# Altium schematic sheet Sheet2.SchDoc
size A3; SheetNumber: 1; SheetTotal: 1
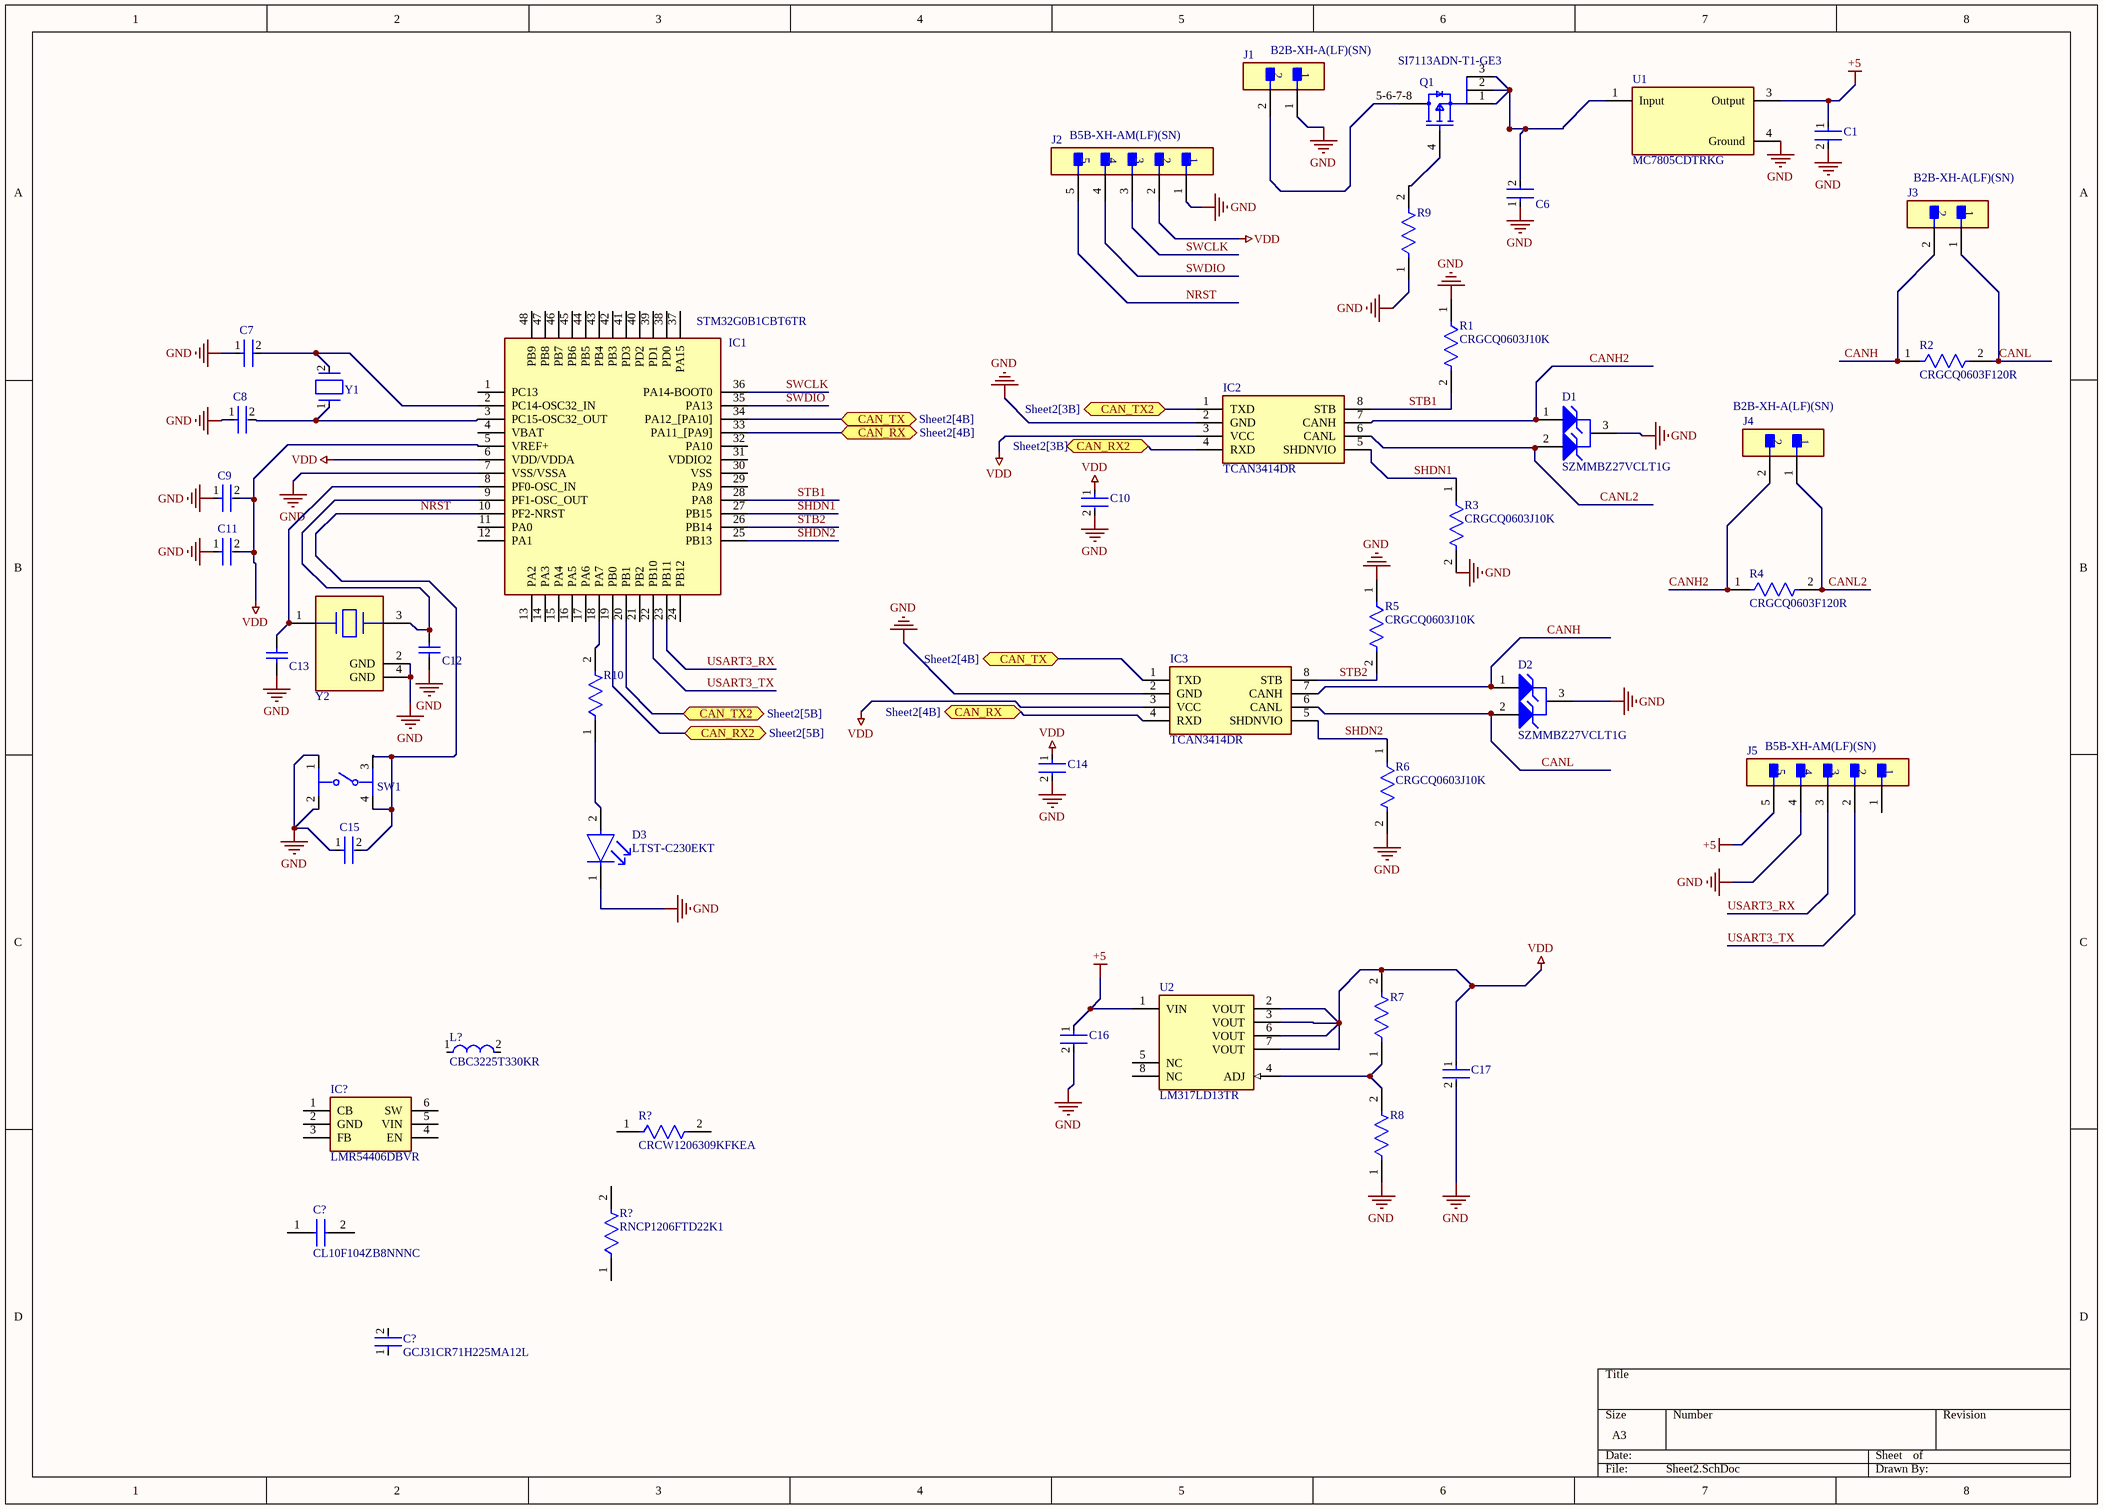
[diagram p0: Sheet2.SchDoc]

## Parts
(Parts that share a designator on the sheet are numbered #1, #2 ... from top to bottom, then left to right.)
C1  CC0805KRX7R5BB104  [FP-CC0805-EA-MFG]  (value not drawn)
C6  C0805C104K5RACTU  [FP-C0805C-DN-MFG]  (value not drawn)
C7  C0805C519D3HACTU  [FP-C0805C-DN-MFG]  (value not drawn)
C8  C0805C519D3HACTU  [FP-C0805C-DN-MFG]  (value not drawn)
C9  C0805C104K5RACTU  [FP-C0805C-DN-MFG]  (value not drawn)
C10  CC0805KRX7R5BB104  [FP-CC0805-EA-MFG]  (value not drawn)
C11  C0805C104K5RACTU  [FP-C0805C-DN-MFG]  (value not drawn)
C12  GRM1885C1H100JA01D  [CAPC1608X90X35LL10T15]  (value not drawn)
C13  GRM1885C1H100JA01D  [CAPC1608X90X35LL10T15]  (value not drawn)
C14  CC0805KRX7R5BB104  [FP-CC0805-EA-MFG]  (value not drawn)
C15  C0805C104K5RACTU  [FP-C0805C-DN-MFG]  (value not drawn)
C16  CC0805KRX7R5BB104  [FP-CC0805-EA-MFG]  (value not drawn)
C17  CC0805KRX7R5BB104  [FP-CC0805-EA-MFG]  (value not drawn)
C?#1  CL10F104ZB8NNNC  [CAPC1608X90N]
C?#2  GCJ31CR71H225MA12L  [FP-GCJ31C-0_3-IPC_B]
D1  SZMMBZ27VCLT1G  [ONSC-SOT-23-3-318-08_V]
D2  SZMMBZ27VCLT1G  [ONSC-SOT-23-3-318-08_V]
D3  LTST-C230EKT  [FP-LTST-C230EKT-MFG]
IC1  STM32G0B1CBT6TR  [QFP50P900X900X160-48N]
IC2  TCAN3414DR  [SOIC127P600X175-8N]
IC3  TCAN3414DR  [SOIC127P600X175-8N]
IC?  LMR54406DBVR  [SOT95P280X145-6N]
J1  B2B-XH-A(LF)(SN)  [FP-B2B-XH-A_LF_SN-MFG]
J2  B5B-XH-AM(LF)(SN)  [FP-B5B-XH-AM_LF_SN-MFG]
J3  B2B-XH-A(LF)(SN)  [FP-B2B-XH-A_LF_SN-MFG]
J4  B2B-XH-A(LF)(SN)  [FP-B2B-XH-A_LF_SN-MFG]
J5  B5B-XH-AM(LF)(SN)  [FP-B5B-XH-AM_LF_SN-MFG]
L?  CBC3225T330KR  [FP-CB3225-IPC_A]
Q1  SI7113ADN-T1-GE3  [FP-S16-2667-SINGLE-MFG]
R1  CRGCQ0603J10K  [FP-CRGCQ0603-IPC_C]
R2  CRGCQ0603F120R  [FP-CRGCQ0603-IPC_C]
R3  CRGCQ0603J10K  [FP-CRGCQ0603-IPC_C]
R4  CRGCQ0603F120R  [FP-CRGCQ0603-IPC_C]
R5  CRGCQ0603J10K  [FP-CRGCQ0603-IPC_C]
R6  CRGCQ0603J10K  [FP-CRGCQ0603-IPC_C]
R7  CRGCQ0603F1K2  [FP-CRGCQ0603-IPC_C]  (value not drawn)
R8  RC3216J202CS  [FP-RC3216-IPC_A]  (value not drawn)
R9  CRGCQ0603F1K2  [FP-CRGCQ0603-IPC_C]  (value not drawn)
R10  RC3216J202CS  [FP-RC3216-IPC_A]  (value not drawn)
R?#1  CRCW1206309KFKEA  [FP-CRCW1206-e3-IPC_B]
R?#2  RNCP1206FTD22K1  [FP-RNCP1206-IPC_C]
SW1  PTS647SK38SMTR2LFS  [FP-PTS647SK38SMTR2LFS-MFG]  (value not drawn)
U1  MC7805CDTRKG  [FP-369C-MFG]
U2  LM317LD13TR  [FP-SO-8-0016023-MFG]
Y1  ABS06-32.768KHZ-9-1-T  [FP-ABS06-MFG]  (value not drawn)
Y2  ABM8G-24.000MHZ-B4Y-T  [FP-ABM8G-MFG]  (value not drawn)

## Ports
CAN_RX2 (bidir, see Sheet2[3B]), CAN_RX2 (bidir, see Sheet2[5B]), CAN_RX (bidir, see Sheet2[4B]), CAN_TX2 (bidir, see Sheet2[3B]), CAN_TX2 (bidir, see Sheet2[5B]), CAN_TX (bidir, see Sheet2[4B])

## Nets
+5: C1.1 C16.1 J5.5 U1.3(Output) U2.1(VIN)
GND: C1.2 C6.1 C7.1 C8.1 C9.1 C10.2 C11.1 C12.1 C13.1 C14.2 C15.1 C16.2 C17.2 D1.3(K) D2.3(K) D3.1(C) IC1.7(VSS/VSSA) IC2.2(GND) IC3.2(GND) J1.1 J2.1 J5.4 R1.1 R3.2 R5.1 R6.2 R8.1 R9.1 SW1.1 SW1.2 U1.4(Ground) Y2.2(GND) Y2.4(GND)
VDD: C9.2 C10.1 C11.2 C14.1 C17.1 IC1.5(VREF+) IC1.6(VDD/VDDA) IC2.3(VCC) IC3.3(VCC) J2.2 R7.2 U2.2(VOUT) U2.3(VOUT) U2.6(VOUT) U2.7(VOUT)
CAN_RX: IC1.33(PA11_[PA9]) IC3.4(RXD) ; port CAN_RX
CAN_RX2: IC1.19(PB0) IC2.4(RXD) ; port CAN_RX2
CAN_TX: IC1.34(PA12_[PA10]) IC3.1(TXD) ; port CAN_TX
CAN_TX2: IC1.20(PB1) IC2.1(TXD) ; port CAN_TX2
CANH: D2.1(A1) IC3.7(CANH) J3.2 R2.1
CANH2: D1.1(A1) IC2.7(CANH) J4.2 R4.1
CANL: D2.2(A2) IC3.6(CANL) J3.1 R2.2
CANL2: D1.2(A2) IC2.6(CANL) J4.1 R4.2
NRST: C15.2 IC1.10(PF2-NRST) J2.5 SW1.3 SW1.4
SHDN1: IC1.27(PB15) IC2.5(SHDNVIO) R3.1
SHDN2: IC1.25(PB13) IC3.5(SHDNVIO) R6.1
STB1: IC1.28(PA8) IC2.8(STB) R1.2
STB2: IC1.26(PB14) IC3.8(STB) R5.2
SWCLK: IC1.36(PA14-BOOT0) J2.3
SWDIO: IC1.35(PA13) J2.4
USART3_RX: IC1.23(PB11) J5.3
USART3_TX: IC1.22(PB10) J5.2
NetC6_2: C6.2 Q1.1(S) Q1.2(S) Q1.3(S) U1.1(Input)
NetC7_2: C7.2 IC1.2(PC14-OSC32_IN) Y1.2
NetC8_2: C8.2 IC1.3(PC15-OSC32_OUT) Y1.1
NetC12_2: C12.2 IC1.9(PF1-OSC_OUT) Y2.3
NetC13_2: C13.2 IC1.8(PF0-OSC_IN) Y2.1
NetD3_2: D3.2(A) R10.1
NetIC1_18: IC1.18(PA7) R10.2
NetJ1_2: J1.2 Q1.5-6-7-8(D)
NetQ1_4: Q1.4(G) R9.2
NetR7_1: R7.1 R8.2 U2.4(ADJ)

Not connected (* = marked no-connect by the designer): C?#1 1 2; C?#2 1 2; IC1 1(PC13) 4(VBAT) 11(PA0) 12(PA1) 13(PA2) 14(PA3) 15(PA4) 16(PA5) 17(PA6) 21(PB2) 24(PB12) 29(PA9) 30(VSS) 31(VDDIO2) 32(PA10) 37(PA15) 38(PD0) 39(PD1) 40(PD2) 41(PD3) 42(PB3) 43(PB4) 44(PB5) 45(PB6) 46(PB7) 47(PB8) 48(PB9); IC? 1(CB) 2(GND) 3(FB) 4(EN) 5(VIN) 6(SW); J5 1; L? 1 2; R?#1 1 2; R?#2 1 2; U2 5(NC) 8(NC)

## Library data of the parts
C1 C10 C14 C16 C17 = CMP-03422-000810-2: CAP CER X7R 0805; RoHS Compliant: Yes
C6 C9 C11 C15 = CMP-2007-00279-2: CAP CER 0.1UF 50V X7R 0805; Manufacturer: KEMET; Value: 0.10 μF; Tolerance: 0.1; Temperature Coefficient: 30ppm/°C; Material: Ceramic; Manufacturer Part Number: C0805C104K5RACTU; Device Class L2: Capacitors; Temperature Range Low: -55°C; Voltage Rating: 50 V; Digikey Description: CAP CER 0.1UF 50V X7R 0805; Category: Cap; ComponentLink2Description: Datasheet; Octopart: https://octopart.com/c0805c104k5ractu-kemet-143926; RoHS: TRUE; ComponentLink2URL: https://content.kemet.com/datasheets/KEM_C1003_C0G_SMD.pdf; Temperature Characteristic: X7R; Temperature: -55°C to +125°C; Height: 0.88mm; Temperature Range High: +125°C; Device Class L1: Passive Components; Automotive: No; Lead Free: Yes; Ipc Land Pattern Name: CAPC200125X78; Device Class L3: Ceramic Capacitors; Mouser Description: Cap Ceramic 0.1uF 50V X7R 10% SMD 2.0 x 1.2 mm 125 C Paper T/R; Capacitance: 0.10 μF; Package: C0805C-DN
C7 C8 = CMP-03020-033346-1: C0805 5.1 pF X8R 30ppm/°C 0.5 pF 25 V; Manufacturer: KEMET; Voltage Rating: 25 V; Tolerance: 0.5 pF; Capacitance: 5.1 pF; Value: 5.1 pF; Material: Ceramic; Category: Cap; Lead Free: Yes; Temperature Characteristic: X8R; Manufacturer Part Number: C0805C519D3HACTU; Ipc Land Pattern Name: CAPC200125X78; ComponentLink2Description: Datasheet; Package: C0805C-DN; Device Class L2: Capacitors; Automotive: No; Octopart: https://octopart.com/c0805c519d3hactu-kemet-88727353; Device Class L1: Passive Components; Temperature Coefficient: 30ppm/°C; Temperature Range High: +125°C; Height: 0.88mm; Temperature Range Low: -55°C; ComponentLink2URL: https://content.kemet.com/datasheets/KEM_C1003_C0G_SMD.pdf; Device Class L3: Ceramic Capacitors; RoHS: TRUE; Temperature: -55°C to +125°C
C12 C13 = CMP-2006-02592-1: Manufacturer: Murata; Part Number: GRM1885C1H100JA01D
C?#1 = CL10F104ZB8NNNC: Capacitor; Manufacturer_Name: SAMSUNG; Datasheet Link: http://uk.rs-online.com/web/p/products/7665449; Height: 0.9mm; Manufacturer_Part_Number: CL10F104ZB8NNNC; Mouser Part Number: 187-CL10F104ZB8NNNC; Mouser Price/Stock: https://www.mouser.co.uk/ProductDetail/Samsung-Electro-Mechanics/CL10F104ZB8NNNC?qs=349EhDEZ59rBbGrsT%2FDZAg%3D%3D; Arrow Part Number: CL10F104ZB8NNNC; Arrow Price/Stock: https://www.arrow.com/en/products/cl10f104zb8nnnc/samsung-electro-mechanics?region=nac
C?#2 = CMP-06035-000750-1: Cap Ceramic 2.2uF 50V X7R 20% Pad SMD 1206 Soft Termination  +125°C Automotive T/R
D1 D2 = CMP-1060-01002-1: 40 W Peak Power Zener Transient Voltage Suppressor, Dual Common Cathode Zeners for ESD Protection, 3-Pin SOT-23, Pb-Free, Tape and Reel; Manufacturer: On Semiconductor; VZ Typ (V): 27; ComponentLink2Description: Datasheet; ComponentLink1Description: Manufacturer URL; PackageVersion: Rev. AP, 11/2009; Packing: Tape and Reel; ComponentLink2URL: http://www.onsemi.cn/pub_link/Collateral/MMBZ15VDLT1-D.PDF; PackageReference: SOT-23-3-318-08; ComponentLink3Description: Package Specification; ComponentLink3URL: http://www.onsemi.cn/pub_link/Collateral/318-08.PDF; DatasheetVersion: Rev. 12; RoHS: Pb-Free; ComponentLink1URL: http://www.onsemi.com/; PackageDescription: 3-Pin Small Outline Transistor, Body 2.92 x 1.3 mm, Pitch 0.95 mm; PartNumber: SZMMBZ27VCLT1G; Mounting Technology: Surface Mount
D3 = CMP-22017-000030-1: LED RED CLEAR CHIP SMD; Forward Current: 30mA; Test Current: 10mA; Number of Elements: 1; Viewing Angle: 130°; Dominant Wavelength: 621nm; Forward Voltage: 2V; Lens Style: Diffused; Power Rating: 100mW; Reverse Voltage: 5V; Wavelength: 630nm; Luminous Intensity: 6mcd; Lens Color: Colorless; Case/Package: 1206; Case Code (Imperial): 1206; Package Quantity: 1; Lead Free: Lead Free; Case Code (Metric): 3216; Height: 1.1mm; Lens Transparency: Clear; Mount: Surface Mount; Depth: 1.6mm; Number of LEDs: 1; Power Dissipation: 100mW; Max Operating Temperature: 85°C; Width: 1.6mm; Color: Red; Number of Pins: 2; Min Operating Temperature: -55°C; Packaging: Tape and Reel; Radiation Hardening: No; Illumination Color: Red; Length: 3.2mm
IC1 = STM32G0B1CBT6TR: Integrated Circuit; Manufacturer_Name: STMicroelectronics; Datasheet Link: https://www.st.com/resource/en/datasheet/stm32g0b1cc.pdf; Height: 1.6mm; Manufacturer_Part_Number: STM32G0B1CBT6TR; Mouser Part Number: 511-STM32G0B1CBT6TR; Mouser Price/Stock: https://www.mouser.co.uk/ProductDetail/STMicroelectronics/STM32G0B1CBT6TR?qs=HoCaDK9Nz5cqFCA6TLpp%252Bw%3D%3D; Arrow Part Number: STM32G0B1CBT6TR; Arrow Price/Stock: https://www.arrow.com/en/products/stm32g0b1cbt6tr/stmicroelectronics?utm_currency=USD&region=nac
IC2 IC3 = TCAN3414DR: Integrated Circuit; Manufacturer_Name: Texas Instruments; Datasheet Link: https://www.ti.com/lit/ds/symlink/tcan3414.pdf?ts=1713723144569&ref_url=https%253A%252F%252Fwww.mouser.ch%252F; Height: 1.75mm; Manufacturer_Part_Number: TCAN3414DR; Mouser Part Number: 595-TCAN3414DR; Mouser Price/Stock: https://www.mouser.co.uk/ProductDetail/Texas-Instruments/TCAN3414DR?qs=mELouGlnn3egF2AojRJddw%3D%3D; Arrow Part Number: TCAN3414DR; Arrow Price/Stock: https://www.arrow.com/en/products/tcan3414dr/texas-instruments?utm_currency=USD&region=nac
IC? = LMR54406DBVR: Integrated Circuit; Manufacturer_Name: Texas Instruments; Datasheet Link: https://www.ti.com/lit/ds/symlink/lmr54406.pdf?ts=1659688249350&ref_url=https%253A%252F%252Fwww.ti.com%252Fproduct%252FLMR54406%252Fpart-details%252FLMR54406DBVR; Height: 1.45mm; Manufacturer_Part_Number: LMR54406DBVR; Mouser Part Number: 595-LMR54406DBVR; Mouser Price/Stock: https://www.mouser.co.uk/ProductDetail/Texas-Instruments/LMR54406DBVR?qs=rSMjJ%252B1ewcQLNU8KVBwgHQ%3D%3D; Arrow Part Number: LMR54406DBVR; Arrow Price/Stock: https://www.arrow.com/en/products/lmr54406dbvr/texas-instruments?utm_currency=USD&region=nac
J1 J3 J4 = CMP-2000-05888-3: CONN HEADER VERT 2POS 2.5MM; Current Rating: 3A; Voltage Rating: 250V; Number of Contacts: 2; Contact Resistance: 20mR; Wire/Cable Gauge: 22AWG; Insulation Resistance: 1GR; Connector Type: Male Pin; Packaging: Bulk; Contact Material: Brass; Lead Free: Lead Free; Orientation: Straight; Contact Plating: Tin; Max Current Rating: 3A; Termination: Solder; Fastening Type: Detent; Depth: 5.75mm; Housing Material: Polyamide; REACH SVHC: No SVHC; Series: XH; Voltage Rating (AC): 250V; Number of Positions: 2; Color: Natural; Contact Type: Male Pin; Max Voltage Rating (DC): 250V; Pitch: 2.5mm; Lead Pitch: 2.5mm; Mount: Through Hole; Max Operating Temperature: 85°C; Length: 7.4mm; Max Voltage Rating (AC): 250V; Min Operating Temperature: -25°C; Number of Rows: 1; Housing Color: White
J2 J5 = CMP-17439-000304-1: CONN HEADER VERT 5POS 2.5MM; Mated Stacking Heights: 9.8mm; Voltage Rating: 250V; Max Current Rating: 3A; Number of Positions: 5; Contact Resistance: 20mR; Depth: 5.75mm; Connector Type: Header; Color: Green; Insulation Material: Nylon; Contact Plating: Copper; Length: 14.9mm; Fastening Type: Detent; Contact Material: Brass; Number of Rows: 1; Contact Type: Male Pin; Housing Material: Polyamide; Housing Color: White; Lead Free: Lead Free; Max Voltage Rating (AC): 250V; Mount: Through Hole; Contact Shape: Square; Min Operating Temperature: -25°C; Packaging: Bulk; Orientation: Straight; Insulation Color: Natural; Series: XH; Flammability Rating: UL94 V-0; Contact Finish - Mating: TIN; Max Operating Temperature: 85°C; Termination: Solder; Pitch: 2.5mm
L? = CMP-14484-000067-1: SMD Inductors 33uH ±10% 0.57A 0.533Ω 1210; Saturation Current: 500mA; Shielding: Unshielded; Test Frequency: 100kHz; DC Current: 570mA; DC Resistance (DCR): 533mR; Self Resonant Frequency: 13MHz; Core Material: Ferrite; Termination: SMD/SMT; Min Operating Temperature: -40°C; Width: 0.098inch; Case Code (Imperial): 1210; Depth: 2.7mm; Length: 3.2mm; Case Code (Metric): 3225; Max Operating Temperature: 105°C; Inductance: 33uH; Current Rating: 570mA; Military Standard: Not; Tolerance: 10%; Lead Free: Lead Free; Package Quantity: 1000; Height: 2.5mm; Height - Seated (Max): 0.106inch; Max DC Current: 570mA; Resistor Type: Wirewound; Series: CBC; Packaging: Tape and Reel; Halogen Free: Halogen Free; Case/Package: 1210; Radiation Hardening: No; RoHS Compliant: Yes; Mount: Surface Mount; Inductance Tolerance: 10%
Q1 = CMP-02550-000064-1: MOSFET P-CH 100V 10.8A 1212-8; Manufacturer: Vishay; Pulse Drain Current: -20A; Reverse Recovery Charge: 80nC; Standoff Height: 0mm; Max Junction Temp: +150°C; Max Forward Diode Voltage: -1.2V; Depletion Mode: False; Turn Off Delay Time: 20ns; Drain To Source Resistance: 0.11Ω; Turn On Delay Time: 10ns; Rthja Max: 36°C/W; Gate Charge At Vgs: 10.9nC @ -10V; Transconductance: 8S; Typ Forward Diode Voltage: -0.8V; Threshold Vgs Max: -2.6V; Drain To Source Voltage: -100V; Power Dissipation: 3.5W; Threshold Vgs Min: -1.1V; Input Capacitace At Vds: 515pF @ -50V; Continuous Drain Current: -3.8A; Number Of P Channels: 1; Reverse Recovery Time: 43ns; Gate To Source Voltage: 20V; Automotive: No; Lead Free: Yes; Temperature Range Low: -55°C; Device Class L1: Discrete Semiconductors; Temperature: -55°C to +150°C; ComponentLink2URL: http://www.vishay.com/docs/77678/si7113adn.pdf; Device Class L3: MOSFETs; Device Class L2: Transistors; Footprint Url: https://www.vishay.com/docs/72597/72597.pdf; Digikey Description: MOSFET P-CH 100V 10.8A 1212-8; RoHS: TRUE; Height: 1.17mm; Package: S16-2667-SINGLE; Octopart: https://octopart.com/si7113adn-t1-ge3-vishay-88182558; ComponentLink2Description: Datasheet; Temperature Range High: +150°C; Manufacturer Part Number: SI7113ADN-T1-GE3; Category: Trans; Drain To Source Breakdown Voltage: -100V; Number Of Channels: 1
R1 R3 R5 R6 = CMP-03211-009884-1: CRGCQ 0603 10K 5%; Manufacturer: TE Connectivity; Tolerance: 0.05; Power Rating: 0.1W; Resistance: 10KΩ; Voltage Rating: 75V; Value: 10KΩ; Temperature Coefficient: ±100ppm/°C; Composition: Thick Film; ComponentLink2URL: https://www.te.com/commerce/DocumentDelivery/DDEController?Action=showdoc&DocId=Data+Sheet%7F1773204-3%7F1%7Fpdf%7FEnglish%7FENG_DS_1773204-3_1.pdf%7F4-2176339-923; Device Class L1: Passive Components; Package: CRGCQ0603; Mouser Description: Res Thick Film 0603 10K Ohm 5% 0.1W(1/10W) ±100ppm/C Pad SMD Automotive T/R; Temperature Range High: +155°C; Category: Res; Device Class L2: Resistors; Height: 0.55mm; RoHS: TRUE; Lead Free: Yes; Ipc Land Pattern Name: RESC16080X45; Temperature: -55°C to +155°C; Series: CRGCQ; Digikey Description: CRGCQ 0603 10K 5%; Octopart: https://octopart.com/crgcq0603j10k-te+connectivity-91018097; Device Class L3: Chip SMD Resistors; Ambient Temperature Range High: +70°C; ComponentLink2Description: Datasheet; Temperature Range Low: -55°C; Manufacturer Part Number: CRGCQ0603J10K
R2 R4 = CMP-03211-001601-1: CRGCQ0603 120Ω 1% ±100ppm/°C 75V; Manufacturer: TE Connectivity; Tolerance: 0.01; Power Rating: 0.1W; Voltage Rating: 75V; Device Class L2: Resistors; Ambient Temperature Range High: +70°C; Mouser Description: Res, Aec-Q200, Thick Film, 120R, 1%, 0603; Composition: Thick Film; Device Class L1: Passive Components; Temperature Range Low: -55°C; Manufacturer Part Number: CRGCQ0603F120R; Lead Free: Yes; Value: 120Ω; ComponentLink2Description: Datasheet; Device Class L3: Chip SMD Resistors; Package: CRGCQ0603; Ipc Land Pattern Name: RESC16080X45; Height: 0.55mm; Category: Res; RoHS: TRUE; Temperature Range High: +155°C; Resistance: 120Ω; Octopart: https://octopart.com/crgcq0603f120r-te+connectivity-91018039; Temperature Coefficient: ±100ppm/°C; ComponentLink2URL: https://www.te.com/commerce/DocumentDelivery/DDEController?Action=showdoc&DocId=Data+Sheet%7F1773204-3%7F1%7Fpdf%7FEnglish%7FENG_DS_1773204-3_1.pdf%7F4-2176339-482; Temperature: -55°C to +155°C; Series: CRGCQ
R7 R9 = CMP-03211-000516-1: CRGCQ 0603 1K2 1%; Manufacturer: TE Connectivity; Power Rating: 0.1W; Resistance: 1.2KΩ; Value: 1.2KΩ; Voltage Rating: 75V; Temperature Coefficient: ±100ppm/°C; Tolerance: 0.01; Octopart: https://octopart.com/crgcq0603f1k2-te+connectivity-91018051; ComponentLink2Description: Datasheet; ComponentLink2URL: https://www.te.com/commerce/DocumentDelivery/DDEController?Action=showdoc&DocId=Data+Sheet%7F1773204-3%7F1%7Fpdf%7FEnglish%7FENG_DS_1773204-3_1.pdf%7F4-2176339-710; Category: Res; Temperature: -55°C to +155°C; Temperature Range High: +155°C; Ipc Land Pattern Name: RESC16080X45; Device Class L2: Resistors; Height: 0.55mm; Ambient Temperature Range High: +70°C; RoHS: TRUE; Package: CRGCQ0603; Temperature Range Low: -55°C; Digikey Description: CRGCQ 0603 1K2 1%; Series: CRGCQ; Lead Free: Yes; Manufacturer Part Number: CRGCQ0603F1K2; Device Class L1: Passive Components; Composition: Thick Film; Device Class L3: Chip SMD Resistors
R8 R10 = CMP-13261-004107-1: Res Thick Film 1206 2kΩ 5% 0.25W ±100ppm/°C Molded SMD T/R; Voltage Rating (DC): 200V; Resistance: 2kR; Max Power Dissipation: 250mW; Features: Moisture Resistant; Min Operating Temperature: -55°C; Radiation Hardening: No; Lead Free: Lead Free; Height: 0.026inch; Tolerance: 5%; Case/Package: 1206; Case Code (Metric): 3216; Max Operating Temperature: 155°C; Case Code (Imperial): 1206; Length: 0.126inch; Contact Plating: Tin; Temperature Coefficient: 100ppm/°C; Packaging: Tape and Reel; Depth: 1.6mm; Composition: Thick Film; Number of Terminations: 2; Width: 0.063inch
R?#1 = CMP-1014-00790-3: RES Thick Film, 309kΩ, 1%, 0.25W, 100ppm/°C, 1206; Max Power Dissipation: 250mW; Voltage Rating (DC): 200V; Resistance: 309kR; Min Operating Temperature: -55°C; Width: 0.063inch; Number of Terminations: 2; Radiation Hardening: No; Temperature Coefficient: 100ppm/°C; Length: 3.2mm; Tolerance: 1%; Lead Free: Lead Free; Military Standard: Not; Weight: 0.000353oz; Number of Pins: 2; Contact Plating: Tin; Packaging: Tape and Reel; Power Rating: 250mW; Height: 0.024inch; Features: Automotive AEC-Q200; Case/Package: 1206; Max Operating Temperature: 155°C; Case Code (Imperial): 1206; Composition: Thick Film; Depth: 1.6mm; Termination: SMD/SMT; Package Quantity: 5000; Case Code (Metric): 3216; Voltage Rating: 200V
R?#2 = CMP-26527-004759-1: 22.1kΩ ±1% 0.5W 1206 High Power Anti-Sulfur Thin Film Chip Resistor; Max Power Dissipation: 500mW; Resistance: 22.1kR; Temperature Coefficient: 100ppm/°C; Series: RNCP; Min Operating Temperature: -55°C; Features: Moisture Resistant; Resistor Type: Thin Film; RoHS Compliant: Yes; Length: 0.122inch; Height: 0.024inch; Packaging: Tape and Reel; Number of Terminations: 2; Case Code (Metric): 3216; Lead Free: Lead Free; Max Operating Temperature: 155°C; Tolerance: 1%; Mount: Surface Mount; Case Code (Imperial): 1206; Case/Package: 1206; Width: 0.059inch
SW1 = CMP-10040-000033-1: TACT 4.5 X 4.5, 3.8 MM H, 2.5N,; Switch Function: Off-Mom; Switch Travel: 0.25mm; Actuator Type: Standard; Illumination Type: Non-Illuminated; Mechanical Life: 100000Cycles; Ratings: IP40; Operating Force: 250gf; Throw Configuration: SPST; Max Operating Temperature: 70°C; Min Operating Temperature: -20°C; Termination: Gull Wing; Mount: Surface Mount; Packaging: Tape and Reel
U1 = CMP-07128-000033-1: IC REG LINEAR 5V 1A DPAK; Max Output Voltage: 5.2V; Dropout Voltage: 2V; Accuracy: 4%; Number of Regulators: 1; Min Input Voltage: 10V; Max Input Voltage: 35V; Output Type: Fixed; Power Supply Rejection Ratio (PSRR): 83dB; Polarity: Positive; Quiescent Current: 3.2mA; Mount: Surface Mount; Number of Pins: 3; Nominal Output Voltage: 5V; Lead Free: Lead Free; Contact Plating: Tin; Packaging: Tape and Reel; Max Output Current: 1A; Width: 6.22mm; Min Operating Temperature: 0°C; Min Output Voltage: 5V; Max Operating Temperature: 125°C; Halogen Free: Halogen Free; Output Current: 1A; Output Voltage: 5V; Case/Package: DPAK; Radiation Hardening: No; Number of Outputs: 1; Height: 2.38mm; Package Quantity: 1; REACH SVHC: No SVHC; Output Voltage Accuracy: 4%; Length: 6.73mm
U2 = CMP-0244-00272-2: IC REG LINEAR POS ADJ 100MA 8SO; Output Voltage: 37V; Number of Regulators: 1; Max Output Current: 200mA; Reference Voltage: 1.3V; Max Input Voltage: 40V; Tolerance: 5%; Min Output Voltage: 1.2V; Output Type: Adjustable; Power Supply Rejection Ratio (PSRR): 80dB; Polarity: Positive; Min Input Voltage: 4.2V; Max Output Voltage: 37V; Height: 1.25mm; Min Operating Temperature: 0°C; Radiation Hardening: No; Output Current: 100mA; Number of Outputs: 1; Case/Package: SO; Number of Pins: 8; Package Quantity: 1; REACH SVHC: No SVHC; Lead Free: Lead Free; Packaging: Tape and Reel; Contact Plating: Tin; Max Operating Temperature: 125°C; Length: 5mm; Mount: Surface Mount; Width: 4mm; Weight: 0.01787oz
Y1 = CMP-27762-003430-2: Crystal 32.768kHz ±10ppm (Tol) 9pF FUND 90kΩ 2-Pin Mini-CSMD T/R; Series Resistance: 90kR; Series: ABS06; Case/Package: CSMD; Package Quantity: 3000; Load Capacitance: 9pF; Number of Pins: 2; Tolerance: 10ppm; RoHS Compliant: Yes; Depth: 1.2mm; Termination: SMD/SMT; Min Operating Temperature: -40°C; Length: 2mm; Packaging: Tape and Reel; Max Operating Temperature: 85°C; Frequency Tolerance: 10ppm; Width: 1.2mm; ESR (Equivalent Series Resistance): 90kR; Radiation Hardening: No; Frequency: 32.768kHz; REACH SVHC: No SVHC; Mount: Surface Mount; Height: 0.6mm
Y2 = CMP-27762-015229-1: Crystal 24MHz ±30ppm (Tol) ±30ppm (Stability) 10pF FUND 60Ω 4-Pin SMD T/R; Series Resistance: 60R; Width: 2.5mm; Case/Package: CSMD; Load Capacitance: 10pF; Max Operating Temperature: 70°C; Depth: 2.5mm; Min Operating Temperature: -20°C; Frequency Stability: 30ppm; Frequency Tolerance: 30ppm; Frequency: 24MHz; Length: 3.2mm; Height: 1mm; Mount: Surface Mount; Lead Free: Lead Free; Tolerance: 30ppm; ESR (Equivalent Series Resistance): 60R; Number of Pins: 4; Termination: SMD/SMT; Operating Frequency: 24 MHz; Package Quantity: 1000; Series: ABM8G; Packaging: Tape and Reel